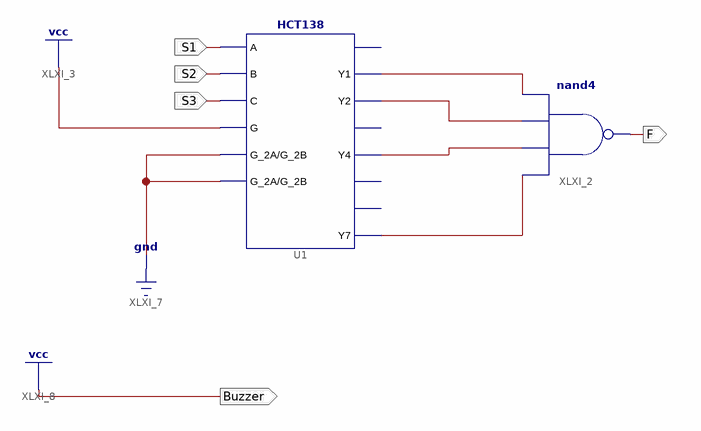
[diagram p0: schematic sheet 1]
// Xilinx ISE schematic Lamp138.sch (kintex7) as structural Verilog: 2 symbols, 5 ports
module Lamp138 (
  input  S1,
  input  S2,
  input  S3,
  output F,
  output Buzzer
);

  wire XLXN_4, XLXN_5, XLXN_6, XLXN_7;

  HCT138 U1 (
    .A(S1), .B(S2), .C(S3), .G(1'b1), .G_2A(1'b0), .G_2B(1'b0), .Y1(XLXN_4), .Y2(XLXN_5), .Y4(XLXN_6),
    .Y7(XLXN_7));  // open: Y0, Y3, Y5, Y6
  nand XLXI_2 (F, XLXN_7, XLXN_6, XLXN_5, XLXN_4);

  assign Buzzer = 1'b1;
endmodule
